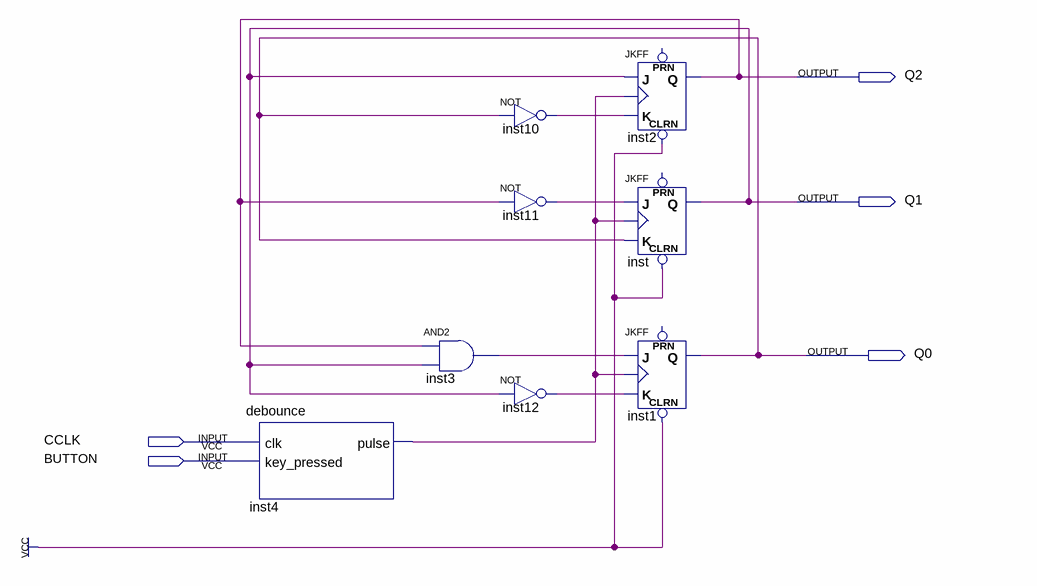
[diagram p0: schematic sheet]
// Quartus schematic counter1_debouncer.bdf as structural Verilog: 8 symbols, 5 pins
module counter1_debouncer (
  input  CCLK,
  input  BUTTON,
  output Q2,
  output Q1,
  output Q0
);

  wire inst3_out, inst4_pulse, inst10_out, inst11_out, inst12_out;

  debounce inst4 (.clk(CCLK), .key_pressed(BUTTON), .pulse(inst4_pulse));
  and inst3 (inst3_out, Q2, Q1);
  not inst10 (inst10_out, Q0);
  not inst11 (inst11_out, Q2);
  not inst12 (inst12_out, Q1);
  JKFF inst2 (.CLRN(1'b1), .K(inst10_out), .J(Q1), .CLK(inst4_pulse), .Q(Q2));  // open: PRN
  JKFF inst (.CLRN(1'b1), .K(Q0), .J(inst11_out), .CLK(inst4_pulse), .Q(Q1));  // open: PRN
  JKFF inst1 (.CLRN(1'b1), .K(inst12_out), .J(inst3_out), .CLK(inst4_pulse), .Q(Q0));  // open: PRN
endmodule
